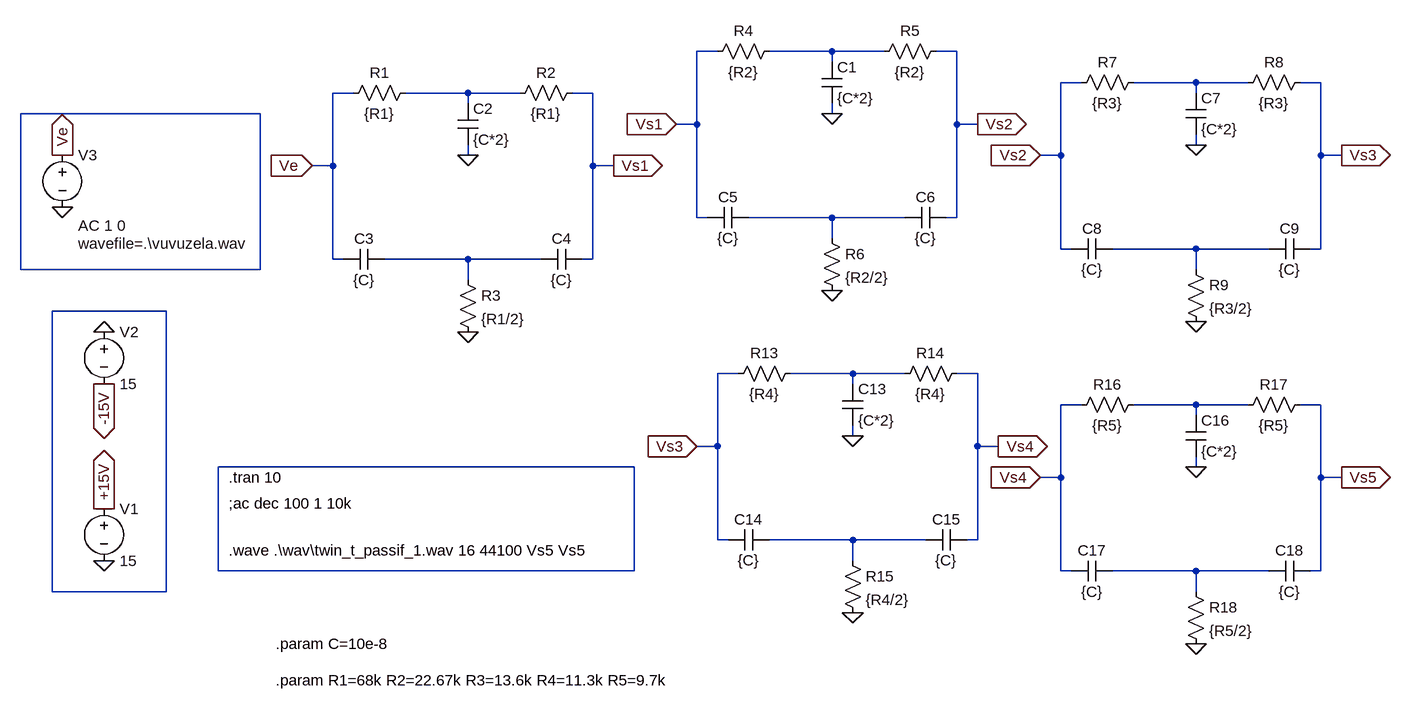
[diagram p0: schematic twin_t_passif.asc]
twin_t_passif.asc, the LTspice schematic file:
Version 4
SHEET 1 3028 776
WIRE 1392 -208 1360 -208
WIRE 1568 -208 1472 -208
WIRE 1648 -208 1568 -208
WIRE 1760 -208 1728 -208
WIRE 1568 -192 1568 -208
WIRE 1952 -160 1920 -160
WIRE 2128 -160 2032 -160
WIRE 2208 -160 2128 -160
WIRE 2320 -160 2288 -160
WIRE 832 -144 800 -144
WIRE 1008 -144 912 -144
WIRE 1088 -144 1008 -144
WIRE 1200 -144 1168 -144
WIRE 2128 -144 2128 -160
WIRE 1008 -128 1008 -144
WIRE 688 -112 320 -112
WIRE 1568 -112 1568 -128
WIRE 1360 -96 1360 -208
WIRE 1360 -96 1328 -96
WIRE 1760 -96 1760 -208
WIRE 1792 -96 1760 -96
WIRE 2128 -64 2128 -80
WIRE 1008 -48 1008 -64
WIRE 1920 -48 1920 -160
WIRE 1920 -48 1888 -48
WIRE 2320 -48 2320 -160
WIRE 2352 -48 2320 -48
WIRE 800 -32 800 -144
WIRE 800 -32 768 -32
WIRE 1200 -32 1200 -144
WIRE 1232 -32 1200 -32
WIRE 1360 48 1360 -96
WIRE 1376 48 1360 48
WIRE 1568 48 1440 48
WIRE 1680 48 1568 48
WIRE 1760 48 1760 -96
WIRE 1760 48 1744 48
WIRE 1568 80 1568 48
WIRE 1920 96 1920 -48
WIRE 1936 96 1920 96
WIRE 2128 96 2000 96
WIRE 2240 96 2128 96
WIRE 2320 96 2320 -48
WIRE 2320 96 2304 96
WIRE 800 112 800 -32
WIRE 816 112 800 112
WIRE 1008 112 880 112
WIRE 1120 112 1008 112
WIRE 1200 112 1200 -32
WIRE 1200 112 1184 112
WIRE 320 128 320 -112
WIRE 688 128 688 -112
WIRE 688 128 320 128
WIRE 2128 128 2128 96
WIRE 1008 144 1008 112
WIRE 544 192 368 192
WIRE 1424 288 1392 288
WIRE 1600 288 1504 288
WIRE 1680 288 1600 288
WIRE 1792 288 1760 288
WIRE 1600 304 1600 288
WIRE 1952 336 1920 336
WIRE 2128 336 2032 336
WIRE 2208 336 2128 336
WIRE 2320 336 2288 336
WIRE 2128 352 2128 336
WIRE 1600 384 1600 368
WIRE 1392 400 1392 288
WIRE 1392 400 1360 400
WIRE 1792 400 1792 288
WIRE 1824 400 1792 400
WIRE 1264 432 624 432
WIRE 2128 432 2128 416
WIRE 1920 448 1920 336
WIRE 1920 448 1888 448
WIRE 2320 448 2320 336
WIRE 2352 448 2320 448
WIRE 1392 544 1392 400
WIRE 1408 544 1392 544
WIRE 1600 544 1472 544
WIRE 1712 544 1600 544
WIRE 1792 544 1792 400
WIRE 1792 544 1776 544
WIRE 1600 576 1600 544
WIRE 624 592 624 432
WIRE 1264 592 1264 432
WIRE 1264 592 624 592
WIRE 1920 592 1920 448
WIRE 1936 592 1920 592
WIRE 2128 592 2000 592
WIRE 2240 592 2128 592
WIRE 2320 592 2320 448
WIRE 2320 592 2304 592
WIRE 368 624 368 192
WIRE 544 624 544 192
WIRE 544 624 368 624
WIRE 2128 624 2128 592
FLAG 448 576 0
FLAG 448 224 0
FLAG 448 496 +15V
IOPIN 448 496 Out
FLAG 448 304 -15V
IOPIN 448 304 Out
FLAG 384 32 0
FLAG 384 -48 Ve
IOPIN 384 -48 Out
FLAG 768 -32 Ve
IOPIN 768 -32 In
FLAG 1232 -32 Vs1
IOPIN 1232 -32 Out
FLAG 1008 -48 0
FLAG 1008 224 0
FLAG 1328 -96 Vs1
IOPIN 1328 -96 In
FLAG 1792 -96 Vs2
IOPIN 1792 -96 Out
FLAG 1568 -112 0
FLAG 1568 160 0
FLAG 1888 -48 Vs2
IOPIN 1888 -48 In
FLAG 2352 -48 Vs3
IOPIN 2352 -48 Out
FLAG 2128 -64 0
FLAG 2128 208 0
FLAG 1360 400 Vs3
IOPIN 1360 400 In
FLAG 1824 400 Vs4
IOPIN 1824 400 Out
FLAG 1600 384 0
FLAG 1600 656 0
FLAG 1888 448 Vs4
IOPIN 1888 448 In
FLAG 2352 448 Vs5
IOPIN 2352 448 Out
FLAG 2128 432 0
FLAG 2128 704 0
SYMBOL voltage 448 480 R0
WINDOW 123 0 0 Left 0
WINDOW 39 0 0 Left 0
SYMATTR InstName V1
SYMATTR Value 15
SYMBOL voltage 448 208 R0
WINDOW 123 0 0 Left 0
WINDOW 39 0 0 Left 0
SYMATTR InstName V2
SYMATTR Value 15
SYMBOL voltage 384 -64 R0
WINDOW 3 24 152 Left 2
WINDOW 123 24 124 Left 2
WINDOW 39 0 0 Left 0
SYMATTR Value wavefile=.\vuvuzela.wav
SYMATTR Value2 AC 1 0
SYMATTR InstName V3
SYMBOL res 928 -160 R90
WINDOW 0 0 56 VBottom 2
WINDOW 3 32 56 VTop 2
SYMATTR InstName R1
SYMATTR Value {R1}
SYMBOL res 1184 -160 R90
WINDOW 0 0 56 VBottom 2
WINDOW 3 32 56 VTop 2
SYMATTR InstName R2
SYMATTR Value {R1}
SYMBOL cap 992 -128 R0
SYMATTR InstName C2
SYMATTR Value {C*2}
SYMBOL cap 880 96 R90
WINDOW 0 0 32 VBottom 2
WINDOW 3 32 32 VTop 2
SYMATTR InstName C3
SYMATTR Value {C}
SYMBOL cap 1184 96 R90
WINDOW 0 0 32 VBottom 2
WINDOW 3 32 32 VTop 2
SYMATTR InstName C4
SYMATTR Value {C}
SYMBOL res 992 128 R0
SYMATTR InstName R3
SYMATTR Value {R1/2}
SYMBOL res 1488 -224 R90
WINDOW 0 0 56 VBottom 2
WINDOW 3 32 56 VTop 2
SYMATTR InstName R4
SYMATTR Value {R2}
SYMBOL res 1744 -224 R90
WINDOW 0 0 56 VBottom 2
WINDOW 3 32 56 VTop 2
SYMATTR InstName R5
SYMATTR Value {R2}
SYMBOL cap 1552 -192 R0
SYMATTR InstName C1
SYMATTR Value {C*2}
SYMBOL cap 1440 32 R90
WINDOW 0 0 32 VBottom 2
WINDOW 3 32 32 VTop 2
SYMATTR InstName C5
SYMATTR Value {C}
SYMBOL cap 1744 32 R90
WINDOW 0 0 32 VBottom 2
WINDOW 3 32 32 VTop 2
SYMATTR InstName C6
SYMATTR Value {C}
SYMBOL res 1552 64 R0
SYMATTR InstName R6
SYMATTR Value {R2/2}
SYMBOL res 2048 -176 R90
WINDOW 0 0 56 VBottom 2
WINDOW 3 32 56 VTop 2
SYMATTR InstName R7
SYMATTR Value {R3}
SYMBOL res 2304 -176 R90
WINDOW 0 0 56 VBottom 2
WINDOW 3 32 56 VTop 2
SYMATTR InstName R8
SYMATTR Value {R3}
SYMBOL cap 2112 -144 R0
SYMATTR InstName C7
SYMATTR Value {C*2}
SYMBOL cap 2000 80 R90
WINDOW 0 0 32 VBottom 2
WINDOW 3 32 32 VTop 2
SYMATTR InstName C8
SYMATTR Value {C}
SYMBOL cap 2304 80 R90
WINDOW 0 0 32 VBottom 2
WINDOW 3 32 32 VTop 2
SYMATTR InstName C9
SYMATTR Value {C}
SYMBOL res 2112 112 R0
SYMATTR InstName R9
SYMATTR Value {R3/2}
SYMBOL res 1520 272 R90
WINDOW 0 0 56 VBottom 2
WINDOW 3 32 56 VTop 2
SYMATTR InstName R13
SYMATTR Value {R4}
SYMBOL res 1776 272 R90
WINDOW 0 0 56 VBottom 2
WINDOW 3 32 56 VTop 2
SYMATTR InstName R14
SYMATTR Value {R4}
SYMBOL cap 1584 304 R0
SYMATTR InstName C13
SYMATTR Value {C*2}
SYMBOL cap 1472 528 R90
WINDOW 0 0 32 VBottom 2
WINDOW 3 32 32 VTop 2
SYMATTR InstName C14
SYMATTR Value {C}
SYMBOL cap 1776 528 R90
WINDOW 0 0 32 VBottom 2
WINDOW 3 32 32 VTop 2
SYMATTR InstName C15
SYMATTR Value {C}
SYMBOL res 1584 560 R0
SYMATTR InstName R15
SYMATTR Value {R4/2}
SYMBOL res 2048 320 R90
WINDOW 0 0 56 VBottom 2
WINDOW 3 32 56 VTop 2
SYMATTR InstName R16
SYMATTR Value {R5}
SYMBOL res 2304 320 R90
WINDOW 0 0 56 VBottom 2
WINDOW 3 32 56 VTop 2
SYMATTR InstName R17
SYMATTR Value {R5}
SYMBOL cap 2112 352 R0
SYMATTR InstName C16
SYMATTR Value {C*2}
SYMBOL cap 2000 576 R90
WINDOW 0 0 32 VBottom 2
WINDOW 3 32 32 VTop 2
SYMATTR InstName C17
SYMATTR Value {C}
SYMBOL cap 2304 576 R90
WINDOW 0 0 32 VBottom 2
WINDOW 3 32 32 VTop 2
SYMATTR InstName C18
SYMATTR Value {C}
SYMBOL res 2112 608 R0
SYMATTR InstName R18
SYMATTR Value {R5/2}
TEXT 640 448 Left 2 !.tran 10
TEXT 712 704 Left 2 !.param C=10e-8
TEXT 712 760 Left 2 !.param R1=68k R2=22.67k R3=13.6k R4=11.3k R5=9.7k
TEXT 640 488 Left 2 !;ac dec 100 1 10k
TEXT 640 560 Left 2 !.wave .\\wav\\twin_t_passif_1.wav 16 44100 Vs5 Vs5

The netlist it stands for:
* twin_t_passif.asc
V1 +15V 0 15
V2 0 -15V 15
V3 Ve 0 wavefile=.\vuvuzela.wav AC 1 0
R1 N003 Ve {R1}
R2 Vs1 N003 {R1}
C2 N003 0 {C*2}
C3 N007 Ve {C}
C4 Vs1 N007 {C}
R3 N007 0 {R1/2}
R4 N001 Vs1 {R2}
R5 Vs2 N001 {R2}
C1 N001 0 {C*2}
C5 N005 Vs1 {C}
C6 Vs2 N005 {C}
R6 N005 0 {R2/2}
R7 N002 Vs2 {R3}
R8 Vs3 N002 {R3}
C7 N002 0 {C*2}
C8 N006 Vs2 {C}
C9 Vs3 N006 {C}
R9 N006 0 {R3/2}
R13 N009 Vs3 {R4}
R14 Vs4 N009 {R4}
C13 N009 0 {C*2}
C14 N012 Vs3 {C}
C15 Vs4 N012 {C}
R15 N012 0 {R4/2}
R16 N010 Vs4 {R5}
R17 Vs5 N010 {R5}
C16 N010 0 {C*2}
C17 N013 Vs4 {C}
C18 Vs5 N013 {C}
R18 N013 0 {R5/2}
.tran 10
.param C=10e-8
.param R1=68k R2=22.67k R3=13.6k R4=11.3k R5=9.7k
;ac dec 100 1 10k
.wave .\wav\twin_t_passif_1.wav 16 44100 Vs5 Vs5
.backanno
.end